# EAGLE schematic BMS_Master_eTable_RevC3_ (EAGLE 6.5.0)

## Sheet 1 of 3
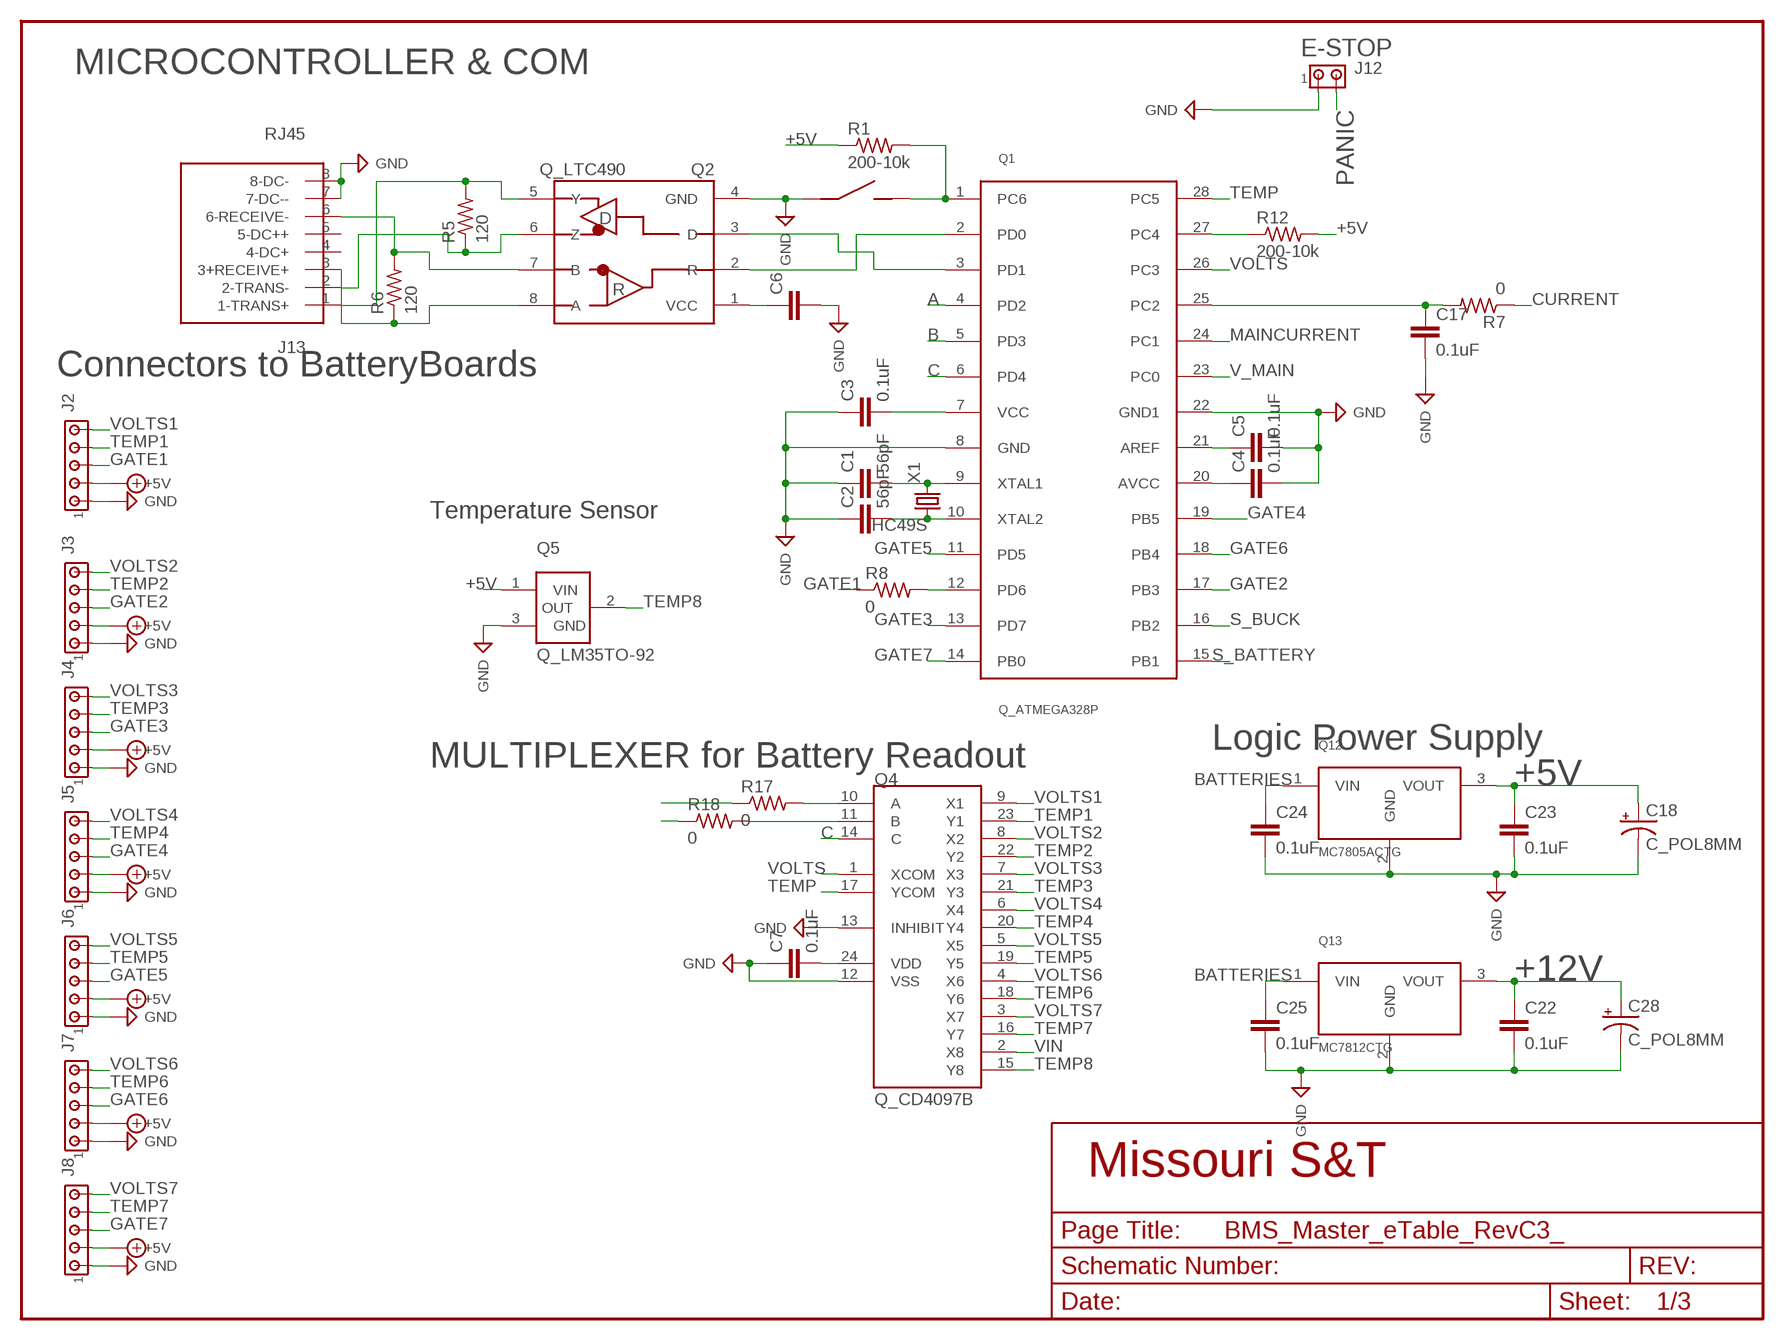
[diagram p0: schematic, sheet 1]

### Parts
C1  56pF  C_CAP_1206  [C_1206]
C2  56pF  C_CAP_1206  [C_1206]
C3  0.1uF  C_CAP_1206  [C_1206]
C4  0.1uF  C_CAP_1206  [C_1206]
C5  0.1uF  C_CAP_1206  [C_1206]
C6  C_CAP_1206  [C_1206]
C7  0.1uF  C_CAP_1206  [C_1206]
C17  0.1uF  C_CAP_1206  [C_1206]
C18  C_POL8MM  [C_8MM]
C22  0.1uF  C_CAP_1206  [C_1206]
C23  0.1uF  C_CAP_1206  [C_1206]
C24  0.1uF  C_CAP_1206  [C_1206]
C25  0.1uF  C_CAP_1206  [C_1206]
C28  C_POL8MM  [C_8MM]
J1  J_MC32857  [J_TOGGLE]
J2  J_MTA5P_100  [J_MTA100_5P]
J3  J_MTA5P_100  [J_MTA100_5P]
J4  J_MTA5P_100  [J_MTA100_5P]
J5  J_MTA5P_100  [J_MTA100_5P]
J6  J_MTA5P_100  [J_MTA100_5P]
J7  J_MTA5P_100  [J_MTA100_5P]
J8  J_MTA5P_100  [J_MTA100_5P]
J12  J_MTA2P_100  [J_MTA100_2P]
J13  RJ45  [RJ45-CAT5E]
Q1  Q_ATMEGA328P  [DIP28]
Q2  Q_LTC490  [DIP8]
Q4  Q_CD4097B  Q_CD4067BRIGHT  [WDIP24]
Q5  Q_LM35TO-92  [TO-92-3]
Q12  MC7805ACTG  Q_LDO  [TO-220]
Q13  MC7812CTG  Q_LDO  [TO-220]
R1  200-10k  R_RES_1206  [R_1206]
R5  120  R_RES_1206  [R_1206]
R6  120  R_RES_1206  [R_1206]
R7  0  R_1/4W  [R_1/4W]
R8  0  R_1/4W  [R_1/4W]
R12  200-10k  R_RES_0805  [R_0805]
R17  0  R_1/4W  [R_1/4W]
R18  0  R_1/4W  [R_1/4W]
X1  HC49S  X_HC49SCRYSTAL  [HC-49]

### Nets
+5V: C3.2 C4.1 C6.1 C7.2 C18.+ C23.1 J2.2 J3.2 J4.2 J5.2 J6.2 J7.2 J8.2 Q1.7(VCC) Q1.20(AVCC) Q2.1(VCC) Q4.24(VDD) Q5.1(VIN) Q12.3(VOUT) R1.1 R12.2 ; supply symbol labelled SUP_+5V ; also sheet 2
+12V: C22.1 C28.+ Q13.3(VOUT) ; also sheet 2,3
A: Q1.4(PD2) R17.1
B: Q1.5(PD3) R18.1
BATTERIES: C24.1 C25.1 Q12.1(VIN) Q13.1(VIN) ; also sheet 3
C: Q1.6(PD4) Q4.14(C)
CURRENT: R7.1 ; also sheet 2
GATE1: J2.3 R8.1
GATE2: J3.3 Q1.17(PB3)
GATE3: J4.3 Q1.13(PD7)
GATE4: J5.3 Q1.19(PB5)
GATE5: J6.3 Q1.11(PD5)
GATE6: J7.3 Q1.18(PB4)
GATE7: J8.3 Q1.14(PB0)
GND: C1.1 C2.1 C3.1 C4.2 C5.2 C6.2 C7.1 C17.2 C18.- C22.2 C23.2 C24.2 C25.2 C28.- J1.P$1 J2.1 J3.1 J4.1 J5.1 J6.1 J7.1 J8.1 J12.1 J13.7(7-DC--) J13.8(8-DC-) Q1.8(GND) Q1.22(GND1) Q2.4(GND) Q4.12(VSS) Q4.13(INHIBIT) Q5.3(GND) Q12.2(GND) Q13.2(GND) ; supply symbol labelled SUP_GND ; also sheet 2,3
MAINCURRENT: Q1.24(PC1) ; also sheet 3
N$2: C2.2 Q1.10(XTAL2) X1.P$1
N$3: C1.2 Q1.9(XTAL1) X1.P$2
N$5: Q4.10(A) R17.2
N$6: C5.1 Q1.21(AREF)
N$7: Q4.11(B) R18.2
N$8: J1.P$2 Q1.1(PC6) R1.2
N$15: C17.1 Q1.25(PC2) R7.2
N$16: Q1.12(PD6) R8.2
N$21: Q1.2(PD0) Q2.2(R)
N$22: Q1.3(PD1) Q2.3(D)
N$32: J13.1(1-TRANS+) Q2.5(Y) R5.2
N$33: J13.2(2-TRANS-) Q2.6(Z) R5.1
N$36: J13.6(6-RECEIVE-) Q2.7(B) R6.2
N$37: J13.3(3+RECEIVE+) Q2.8(A) R6.1
PANIC: J12.2 Q1.27(PC4) R12.1
S_BATTERY: Q1.15(PB1) ; also sheet 3
S_BUCK: Q1.16(PB2) ; also sheet 2
TEMP: Q1.28(PC5) Q4.17(YCOM)
TEMP1: J2.4 Q4.23(Y1)
TEMP2: J3.4 Q4.22(Y2)
TEMP3: J4.4 Q4.21(Y3)
TEMP4: J5.4 Q4.20(Y4)
TEMP5: J6.4 Q4.19(Y5)
TEMP6: J7.4 Q4.18(Y6)
TEMP7: J8.4 Q4.16(Y7)
TEMP8: Q4.15(Y8) Q5.2(OUT)
V_MAIN: Q1.23(PC0) ; also sheet 2
VIN: Q4.2(X8) ; also sheet 2
VOLTS: Q1.26(PC3) Q4.1(XCOM)
VOLTS1: J2.5 Q4.9(X1)
VOLTS2: J3.5 Q4.8(X2)
VOLTS3: J4.5 Q4.7(X3)
VOLTS4: J5.5 Q4.6(X4)
VOLTS5: J6.5 Q4.5(X5)
VOLTS6: J7.5 Q4.4(X6)
VOLTS7: J8.5 Q4.3(X7)
Unconnected: J13.4(4-DC+) J13.5(5-DC++)

### Notes on the sheet
- E-STOP
- MICROCONTROLLER & COM
- Connectors to BatteryBoards
- Temperature Sensor
- Logic Power Supply
- MULTIPLEXER for Battery Readout

## Sheet 2 of 3
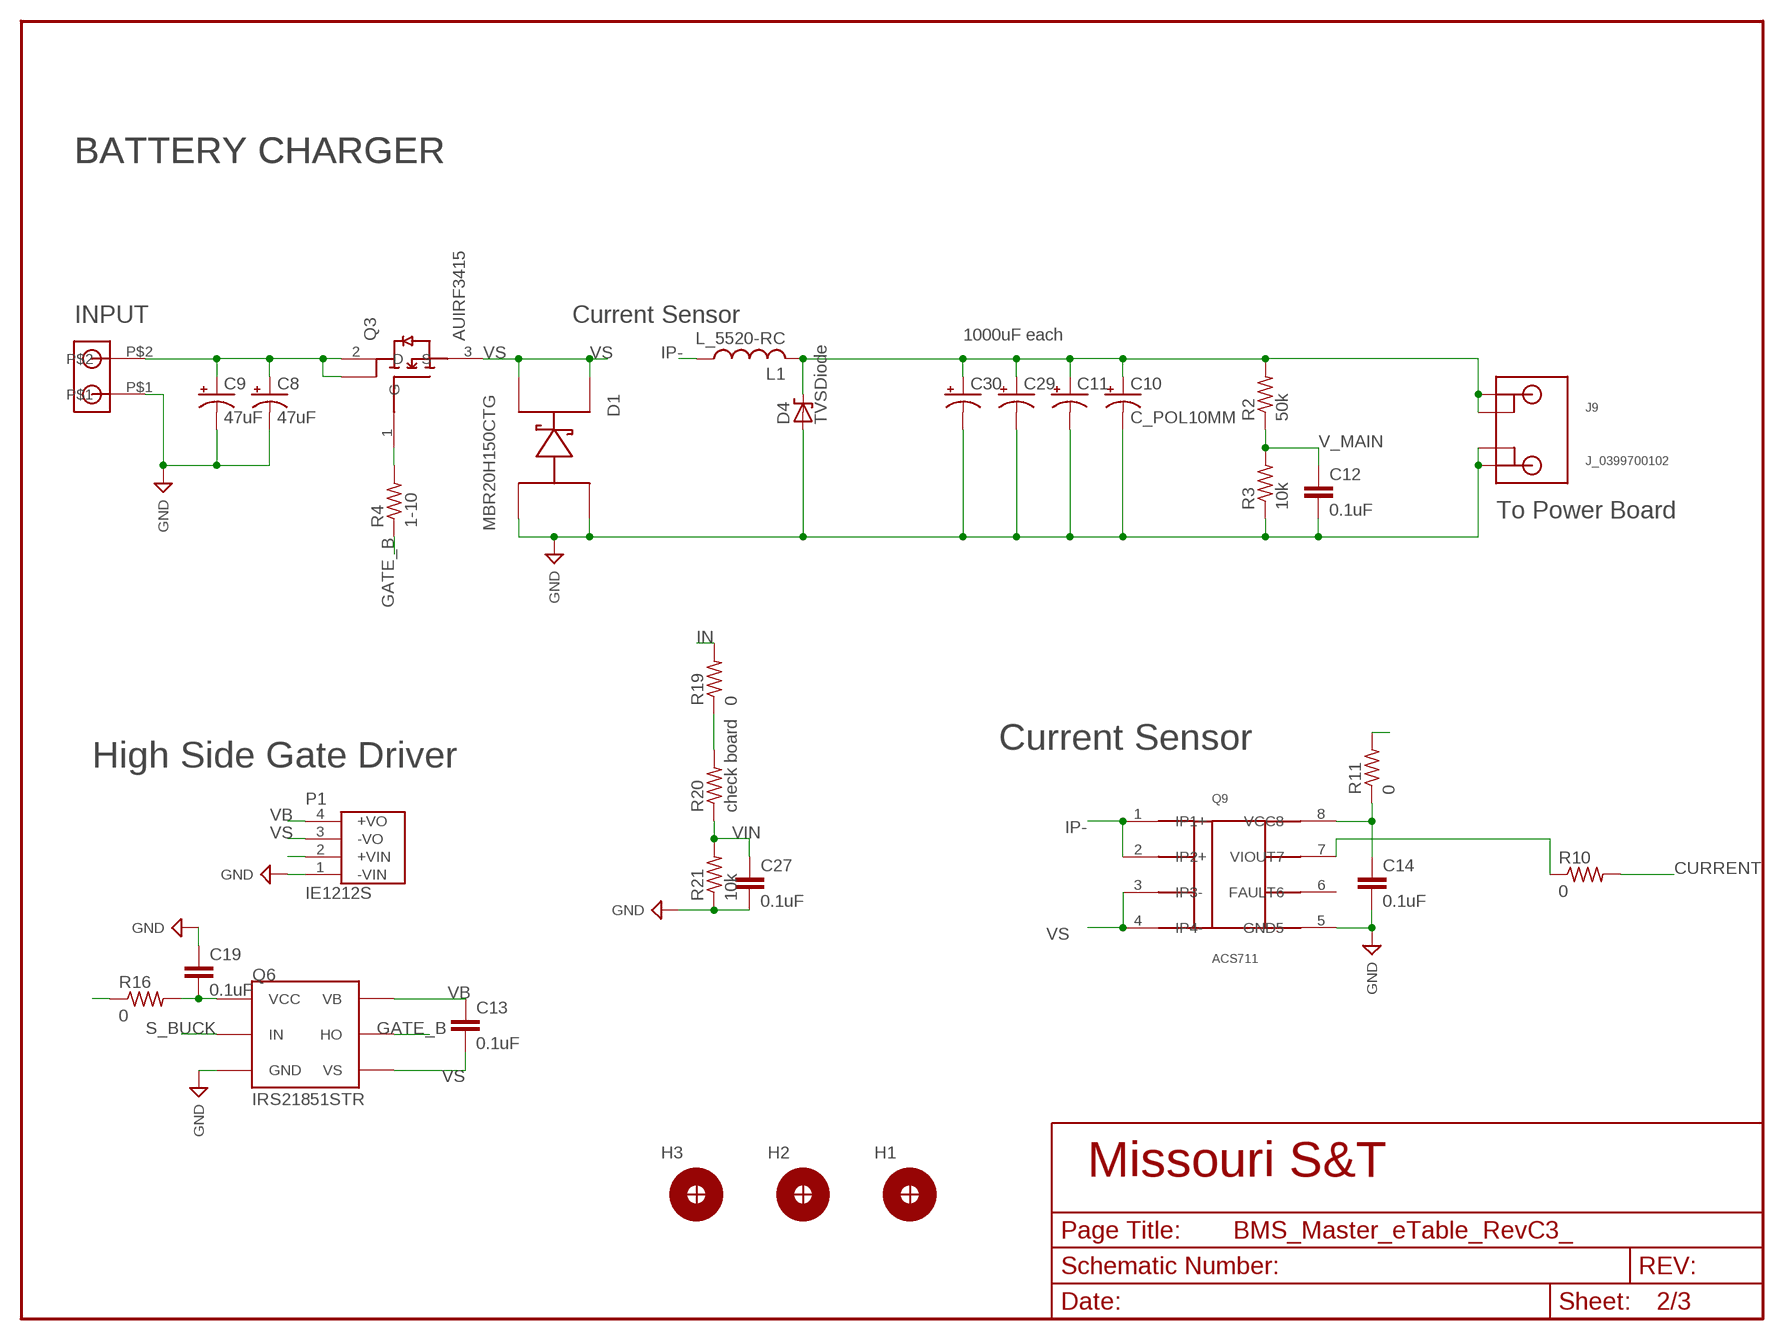
[diagram p1: schematic, sheet 2]

### Parts
C8  47uF  C_POL10MM  [C_10MM]
C9  47uF  C_POL10MM  [C_10MM]
C10  C_POL10MM  [C_10MM]
C11  C_POL10MM  [C_10MM]
C12  0.1uF  C_CAP_1206  [C_1206]
C13  0.1uF  C_CAP_1206  [C_1206]
C14  0.1uF  C_CAP_1206  [C_1206]
C19  0.1uF  C_CAP_1206  [C_1206]
C27  0.1uF  C_CAP_1206  [C_1206]
C29  C_POL10MM  [C_10MM]
C30  C_POL10MM  [C_10MM]
D1  MBR20H150CTG  D_MBR20H150CTG  [TO-220-FLAT]
D4  TVSDiode  D_1.5KE480A_D3.5MM_LS15.24MM  [DIODE_D3.5MM_LS15.24MM]
H1  H_MNTHOLE_#6  [H_MNTHOLE_#6]
H2  H_MNTHOLE_#6  [H_MNTHOLE_#6]
H3  H_MNTHOLE_#6  [H_MNTHOLE_#6]
J9  J_0399700102  [J_2CONHC]
J10  J_1546074-2  [THERM_BLOCK_2]
L1  L_5520-RC  [L_5520-RC]
P1  IE1212S  TME1215S  [TME1215S]
Q3  AUIRF3415  Q_CSD18532KCSPCB  [TO-220-FLAT]
Q6  IRS21851STR  Q_IRS21851STR  [SOIC8]
Q9  ACS711  Q_SO8ACS711  [Q_SO8]
R2  50k  R_1/4W  [R_1/4W]
R3  10k  R_RES_1206  [R_1206]
R4  1-10  R_RES_1206  [R_1206]
R10  0  R_1/4W  [R_1/4W]
R11  0  R_1/4W  [R_1/4W]
R16  0  R_1/4W  [R_1/4W]
R19  0  R_1/4W  [R_1/4W]
R20  check board  R_1/4W  [R_1/4W]
R21  10k  R_RES_1206  [R_1206]

### Nets
+5V: R11.2 ; also sheet 1
+5V1: C14.1 Q9.8(VCC8) R11.1 ; also sheet 3
+12V: R16.1 ; also sheet 1,3
+12V1: C19.2 P1.2(+VIN) Q6.1(VCC) R16.2
CURRENT: R10.2 ; also sheet 1
GATE_B: Q6.7(HO) R4.1
GND: C8.P$2(-) C9.P$2(-) C10.P$2(-) C11.P$2(-) C12.2 C14.2 C19.1 C27.2 C29.P$2(-) C30.P$2(-) D1.1(A1) D1.3(A2) D4.A J9.PIN2-1(2-1) J9.PIN2-2(2-2) J10.P$1 P1.1(-VIN) Q6.4(GND) Q9.5(GND5) R3.1 R21.1 ; supply symbol labelled SUP_GND ; also sheet 1,3
IN: C8.P$1(+) C9.P$1(+) J10.P$2 Q3.2(D) Q3.4 R19.2
IP-: L1.1 Q9.1(IP1+) Q9.2(IP2+)
MAIN: C10.P$1(+) C11.P$1(+) C29.P$1(+) C30.P$1(+) D4.C(K) J9.PIN1-1(1-1) J9.PIN1-2(1-2) L1.2 R2.2 ; also sheet 3
N$9: Q9.7(VIOUT7) R10.1
N$11: R19.1 R20.2
N$31: Q3.1(G) R4.2
S_BUCK: Q6.2(IN) ; also sheet 1
V_MAIN: C12.1 R2.1 R3.2 ; also sheet 1
VB: C13.1 P1.4(+VO) Q6.8(VB)
VIN: C27.1 R20.1 R21.2 ; also sheet 1
VS: C13.2 D1.2(C1) D1.4(C2) P1.3(-VO) Q3.3(S) Q6.6(VS) Q9.3(IP3-) Q9.4(IP4-)
Unconnected: H1.1 H2.1 H3.1 Q9.6(FAULT6)

### Notes on the sheet
- BATTERY CHARGER | BATTERY CHARGER
- INPUT | Current Sensor
- 1000uF each
- To Power Board
- Current Sensor
- High Side Gate Driver

## Sheet 3 of 3
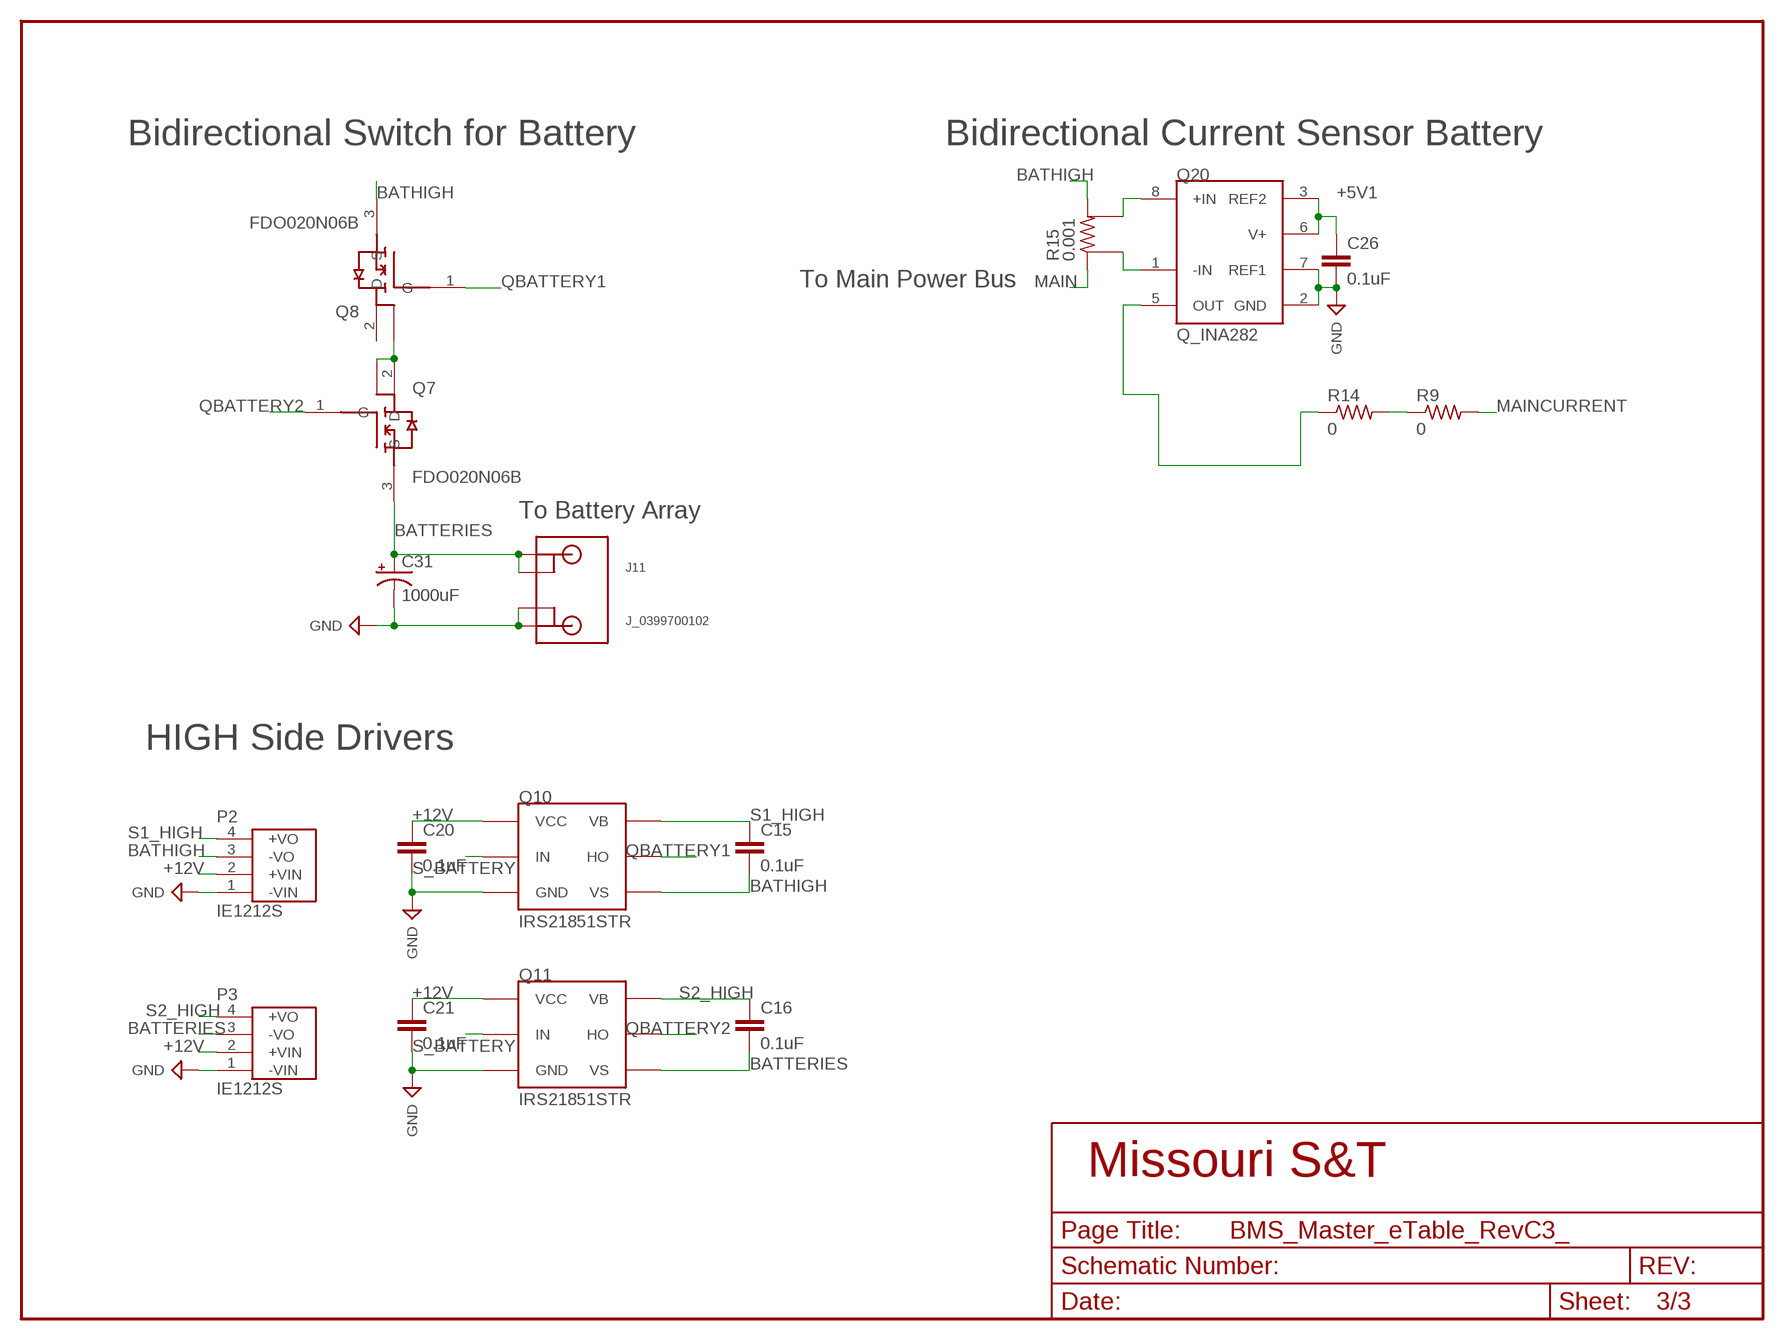
[diagram p2: schematic, sheet 3]

### Parts
C15  0.1uF  C_CAP_1206  [C_1206]
C16  0.1uF  C_CAP_1206  [C_1206]
C20  0.1uF  C_CAP_1206  [C_1206]
C21  0.1uF  C_CAP_1206  [C_1206]
C26  0.1uF  C_CAP_1206  [C_1206]
C31  1000uF  C_POL10MM  [C_10MM]
J11  J_0399700102  [J_2CONHC]
P2  IE1212S  TME1215S  [TME1215S]
P3  IE1212S  TME1215S  [TME1215S]
Q7  FDO020N06B  Q_CSD18532KCSPCB  [TO-220-FLAT]
Q8  FDO020N06B  Q_CSD18532KCSPCB  [TO-220-FLAT]
Q10  IRS21851STR  Q_IRS21851STR  [SOIC8]
Q11  IRS21851STR  Q_IRS21851STR  [SOIC8]
Q20  Q_INA282  Q_INA28  [SOIC8]
R9  0  R_1/4W  [R_1/4W]
R14  0  R_1/4W  [R_1/4W]
R15  0.001  R_FC4L110R001JER  [R_FC4L]

### Nets
+5V1: C26.1 Q20.3(REF2) Q20.6(V+) ; also sheet 2
+12V: C20.1 C21.1 P2.2(+VIN) P3.2(+VIN) Q10.1(VCC) Q11.1(VCC) ; also sheet 1,2
BATHIGH: C15.2 P2.3(-VO) Q8.3(S) Q10.6(VS) R15.2
BATTERIES: C16.2 C31.P$1(+) J11.PIN1-1(1-1) J11.PIN1-2(1-2) P3.3(-VO) Q7.3(S) Q11.6(VS) ; also sheet 1
GND: C20.2 C21.2 C26.2 C31.P$2(-) J11.PIN2-1(2-1) J11.PIN2-2(2-2) P2.1(-VIN) P3.1(-VIN) Q10.4(GND) Q11.4(GND) Q20.2(GND) Q20.7(REF1) ; supply symbol labelled SUP_GND ; also sheet 1,2
INT_BAT: Q7.2(D) Q7.4 Q8.4
MAIN: R15.1 ; also sheet 2
MAINCURRENT: R9.2 ; also sheet 1
N$4: Q20.5(OUT) R14.1
N$12: Q20.8(+IN) R15.SENSE2
N$13: Q20.1(-IN) R15.SENSE1
N$14: R9.1 R14.2
QBATTERY1: Q8.1(G) Q10.7(HO)
QBATTERY2: Q7.1(G) Q11.7(HO)
S1_HIGH: C15.1 P2.4(+VO) Q10.8(VB)
S2_HIGH: C16.1 P3.4(+VO) Q11.8(VB)
S_BATTERY: Q10.2(IN) Q11.2(IN) ; also sheet 1
Unconnected: Q8.2(D)

### Notes on the sheet
- Bidirectional Switch for Battery | Bidirectional Current Sensor Battery
- To Main Power Bus
- To Battery Array
- HIGH Side Drivers

## Library data of the parts
C1-C7 C12-C17 C19-C27 = Lib_Passive:C_CAP
C8-C11 C18 C28-C31 = PCB0M1:C_POL: Alum Elect. Cap with 10mm diameter, 5mm lead spacing and 0.7mm lead diameter
D1 = PCB0M1:D_MBR20H150CTG: 150V 20A Schottky Diode TO-220 Flat Mounted
D4 = Lib_Katlyn:D_1.5KE480A: Zener Diode
H1-H3 = Lib_TH:H_MNTHOLE
J1 = PCB0M1:J_MC32857: SWITCH, TACTILE, SPST-NO, 50mA, THD
J2-J8 = Lib_TH:J_MTA5P
J9 J11 = PCB0M1:J_0399700102: High Current Power Connector
J10 = PCB0M1:J_1546074-2
J12 = Lib_TH:J_MTA2P
J13 = PCB0M1:RJ45
L1 = PCB0M1:L_5520-RC: 100uH 10A Inductor
P1-P3 = SCC Fib:TME1215S
Q1 = PCB0M1:Q_ATMEGA328P: ATMEGA 328P in 28PIN PDIP package
Q2 = PCB0M1:Q_LTC490: IC, RS422-RS485 DRVR
Q3 Q7 Q8 = PCB0M1:Q_CSD18532KCS: 60V 100A N Channel MOSFET
Q4 = PCB0M1:Q_CD4067B: Differential 8:1 Multiplexer
Q5 = PCB0M1:Q_LM35: IC, TEMPERATURE SENSOR, 0.4°C, TO-92-3
Q6 Q10 Q11 = PCB0M1:Q_IRS21851STR: 4A 600V 130ns High Side Driver
Q9 = Lib_MPPT:Q_SO8
Q12 Q13 = PCB0M1:Q_LDO: LDO with fixed ouput voltage
Q20 = PCB0M1:Q_INA28: 10Khz Bidirectional Current Sense Amplifier
R1 R3 R12 R21 = Lib_Passive:R_RES
R2 R7-R11 R14 R16-R20 = Lib_TH:R
R4-R6 = Lib_Passive - Copy:R_RES
R15 = PCB0M1:R_FC4L110R001JER
X1 = PCB0M1:X_HC49SCRYSTAL: CRYSTAL METAL CAN, 16MHZ, 18PF, HC-49/US